# EAGLE schematic DIABETO_BLE (EAGLE 6.1)
AUTHOR: Vishal Chavan

## Sheet 1 of 2
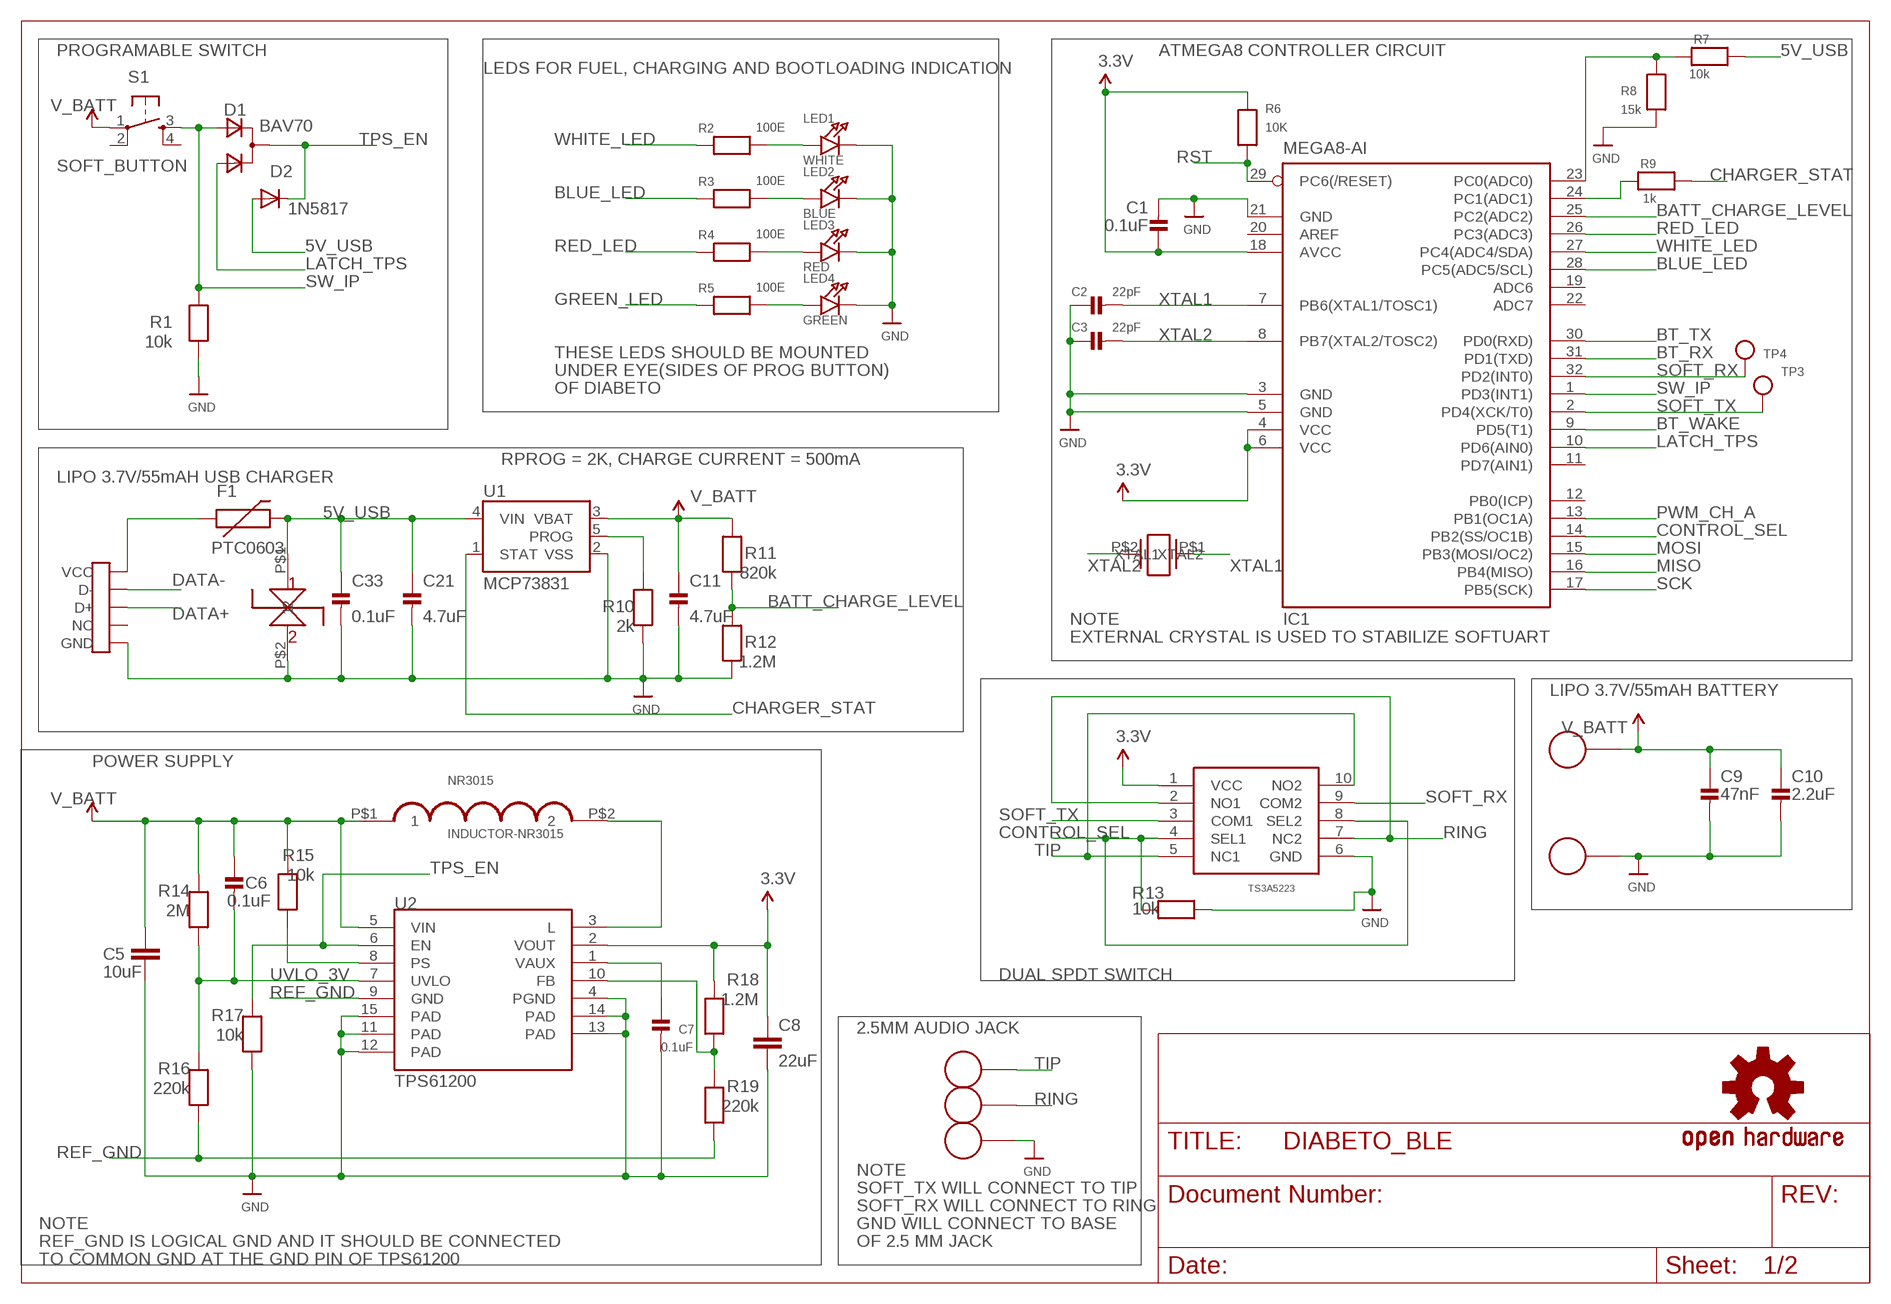
[diagram p0: schematic, sheet 1]

### Parts
BAT-  TIP  1X01_ROUND  [1X01_ROUND]
C1  0.1uF  CAP_CERAMIC_0603  [_0603]
C2  22pF  CAP_CERAMIC_0402  [_0402]
C3  22pF  CAP_CERAMIC_0402  [_0402]
C5  10uF  CAP1206  [1206]
C6  0.1uF  CAP_CERAMIC_0603  [_0603]
C7  0.1uF  CAP_CERAMIC_0603  [_0603]
C8  22uF  CAP0805  [0805]
C9  47nF  CAP_CERAMIC_0603  [_0603]
C10  2.2uF  CAP_CERAMIC_0603  [_0603]
C11  4.7uF  CAP_CERAMIC_0603  [_0603]
C21  4.7uF  CAP_CERAMIC_0603  [_0603]
C33  0.1uF  CAP_CERAMIC_0603  [_0603]
D1  BAV70  D_2ASOT23  [SOT-23]
D2  1N5817  DIODESOD-123  [SOD-123]
F1  PTC0603  [0603]
IC1  MEGA8-AI  [TQFP32-08]
LED1  WHITE  LED0603  [CHIPLED_0603]
LED2  BLUE  LED0603  [CHIPLED_0603]
LED3  RED  LED0603  [CHIPLED_0603]
LED4  GREEN  LED0603  [CHIPLED_0603]
NR3015  INDUCTOR-NR3015  [INDUCTOR-NR3015]
R1  10k  RESISTOR_0603  [_0603]
R2  100E  RESISTOR_0603  [_0603]
R3  100E  RESISTOR_0603  [_0603]
R4  100E  RESISTOR_0603  [_0603]
R5  100E  RESISTOR_0603  [_0603]
R6  10K  RESISTOR_0603  [_0603]
R7  10k  RESISTOR_0603  [_0603]
R8  15k  RESISTOR_0603  [_0603]
R9  1k  RESISTOR_0603  [_0603]
R10  2k  RESISTOR_0603  [_0603]
R11  820k  RESISTOR_0603  [_0603]
R12  1.2M  RESISTOR_0603  [_0603]
R13  10k  RESISTOR_0603  [_0603]
R14  2M  RESISTOR_0603  [_0603]
R15  10k  RESISTOR_0603  [_0603]
R16  220k  RESISTOR_0603  [_0603]
R17  10k  RESISTOR_0603  [_0603]
R18  1.2M  RESISTOR_0603  [_0603]
R19  220k  RESISTOR_0603  [_0603]
S1  SOFT_BUTTON  TAC_SWITCHSMD  [TACTILE_SWITCH_SMD]
TIP  TIP  1X01_ROUND  [1X01_ROUND]
TIP1  TIP  1X01_ROUND  [1X01_ROUND]
TP3  TESTPOINTROUND1MM  [TESTPOINT_ROUND_1MM]
TP4  TESTPOINTROUND1MM  [TESTPOINT_ROUND_1MM]
U1  MCP73831  [SOT23-5]
U2  TPS61200  [QFN-10_PAD]
U$2  MICRO_USB_DIABETOMICRO_USB_SMD  [MICRO_USB_DIABETO]
U$4  TVS_DIODE  [0603]
U$20  TS3A5223  [TS3A5223-QFN]
U$21  OSHW-LOGOS  [OSHW-LOGO-S]
U$23  8MHZ  NX5032GA  [5X3.2_2PAD]
U$26  1X01_ROUND  [1X01_ROUND]
U$28  1X01_ROUND  [1X01_ROUND]

### Nets
3.3V: C1.1 C8.1 IC1.4(VCC) IC1.6(VCC) IC1.18(AVCC) R6.2 R18.2 U2.2(VOUT) U$20.1(VCC) ; also sheet 2
5V_USB: C21.1 C33.1 D2.A F1.2 R7.1 U1.4(VIN) U$4.P$1
BATT_CHARGE_LEVEL: IC1.25(PC2(ADC2)) R11.1 R12.2
BLUE_LED: IC1.28(PC5(ADC5/SCL)) R3.2
BT_RX: IC1.31(PD1(TXD)) ; also sheet 2
BT_TX: IC1.30(PD0(RXD)) ; also sheet 2
BT_WAKE: IC1.9(PD5(T1)) ; also sheet 2
CHARGER_STAT: R9.1 U1.1(STAT)
CONTROL_SEL: IC1.14(PB2(SS/OC1B)) R13.2 U$20.4(SEL1) U$20.8(SEL2)
DATA+: U$2.P$3(D+) ; also sheet 2
DATA-: U$2.P$6(D-) ; also sheet 2
GND: BAT-.P$1 C1.2 C2.1 C3.1 C5.2 C7.2 C8.2 C9.2 C10.2 C11.2 C21.2 C33.2 IC1.3(GND) IC1.5(GND) IC1.21(GND) LED1.C LED2.C LED3.C LED4.C R1.1 R8.2 R10.1 R12.1 R13.1 R17.1 U1.2(VSS) U2.4(PGND) U2.11(PAD) U2.12(PAD) U2.13(PAD) U2.14(PAD) U2.15(PAD) U$2.P$5(GND) U$4.P$2 U$20.6(GND) U$28.P$1 ; also sheet 2
GREEN_LED: R5.2 ; also sheet 2
L: NR3015.P$2 U2.3(L)
LATCH_TPS: D1.3(A2) IC1.10(PD6(AIN0))
MISO: IC1.16(PB4(MISO)) ; also sheet 2
MOSI: IC1.15(PB3(MOSI/OC2)) ; also sheet 2
N$1: R10.2 U1.5(PROG)
N$2: LED1.A R2.1
N$3: LED2.A R3.1
N$4: C7.1 U2.1(VAUX)
N$5: R18.1 R19.2 U2.10(FB)
N$7: R15.1 U2.8(PS)
N$8: F1.1 U$2.P$7(VCC)
N$11: LED3.A R4.1
N$16: LED4.A R5.1
N$17: IC1.24(PC1(ADC1)) R9.2
N$18: IC1.23(PC0(ADC0)) R7.2 R8.1
PWM_CH_A: IC1.13(PB1(OC1A)) ; also sheet 2
RED_LED: IC1.26(PC3(ADC3)) R4.2
REF_GND: R16.1 R19.1 U2.9(GND)
RING: U$20.2(NO1) U$20.7(NC2) U$26.P$1
RST: IC1.29(PC6(/RESET)) R6.1 ; also sheet 2
SCK: IC1.17(PB5(SCK)) ; also sheet 2
SOFT_RX: IC1.32(PD2(INT0)) TP4.P$1 U$20.9(COM2)
SOFT_TX: IC1.2(PD4(XCK/T0)) TP3.P$1 U$20.3(COM1)
SW_IP: D1.2(A1) IC1.1(PD3(INT1)) R1.2 S1.3
TIP: TIP.P$1 U$20.5(NC1) U$20.10(NO2)
TPS_EN: D1.1(C) D2.C R17.2 U2.6(EN)
UVLO_3V: C6.2 R14.1 R16.2 U2.7(UVLO)
V_BATT: C5.1 C6.1 C9.1 C10.1 C11.1 NR3015.P$1 R11.2 R14.2 R15.2 S1.1 TIP1.P$1 U1.3(VBAT) U2.5(VIN)
WHITE_LED: IC1.27(PC4(ADC4/SDA)) R2.2
XTAL1: C2.2 IC1.7(PB6(XTAL1/TOSC1)) U$23.P$1(XTAL1)
XTAL2: C3.2 IC1.8(PB7(XTAL2/TOSC2)) U$23.P$2(XTAL2)
Unconnected: IC1.11(PD7(AIN1)) IC1.12(PB0(ICP)) IC1.19(ADC6) IC1.20(AREF) IC1.22(ADC7) S1.2 S1.4 U$2.P$4(NC)

### Notes on the sheet
- PROGRAMABLE SWITCH | ATMEGA8 CONTROLLER CIRCUIT
- LEDS FOR FUEL, CHARGING AND BOOTLOADING INDICATION
- THESE LEDS SHOULD BE MOUNTED
- UNDER EYE(SIDES OF PROG BUTTON)
- OF DIABETO
- RPROG = 2K, CHARGE CURRENT = 500mA
- LIPO 3.7V/55mAH USB CHARGER
- NOTE
- EXTERNAL CRYSTAL IS USED TO STABILIZE SOFTUART
- LIPO 3.7V/55mAH BATTERY
- POWER SUPPLY
- DUAL SPDT SWITCH
- 2.5MM AUDIO JACK
- NOTE
- SOFT_TX WILL CONNECT TO TIP
- SOFT_RX WILL CONNECT TO RING
- NOTE | GND WILL CONNECT TO BASE
- REF_GND IS LOGICAL GND AND IT SHOULD BE CONNECTED | OF 2.5 MM JACK
- TO COMMON GND AT THE GND PIN OF TPS61200

## Sheet 2 of 2
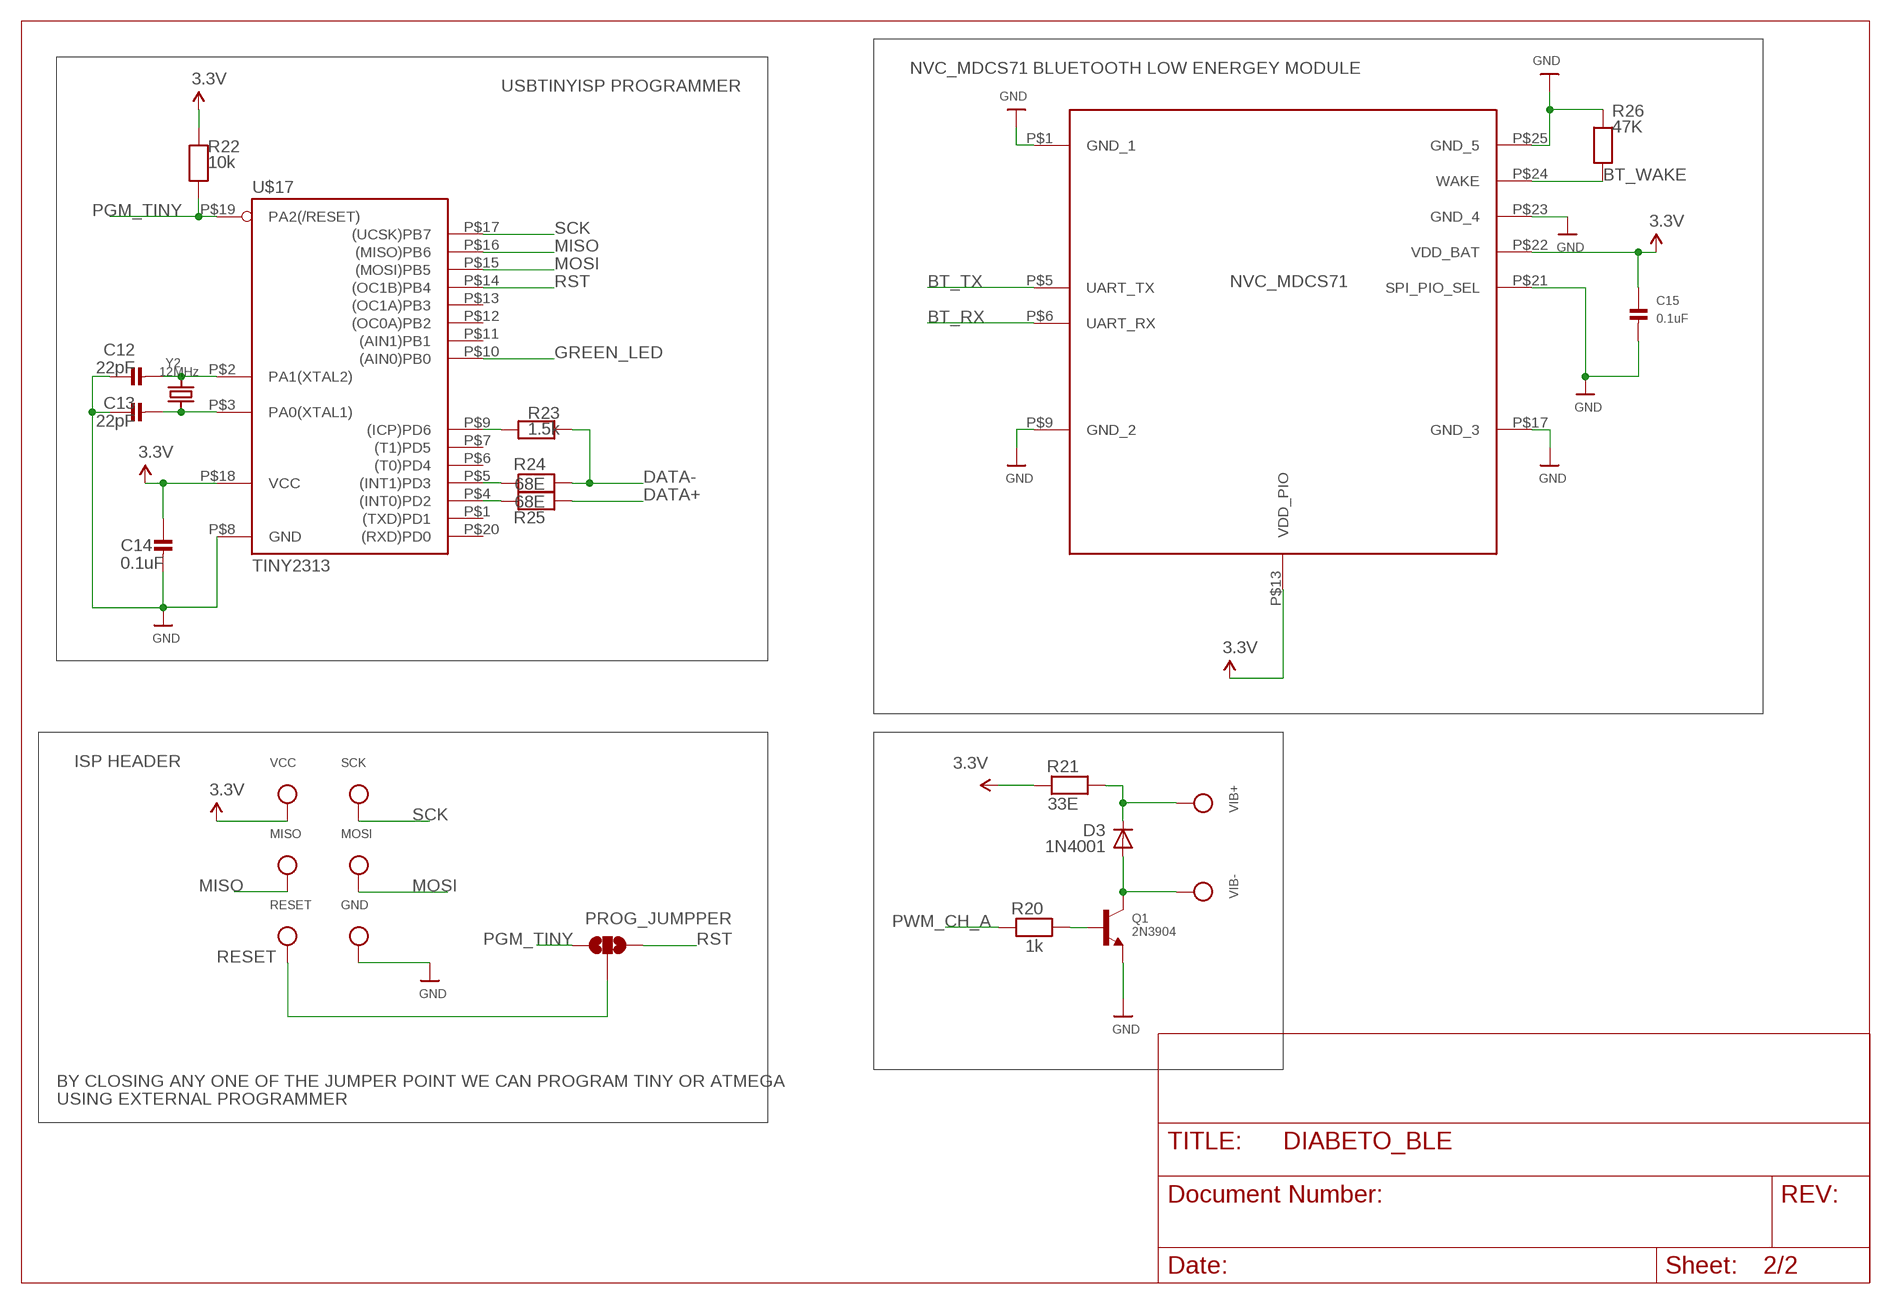
[diagram p1: schematic, sheet 2]

### Parts
C12  22pF  CAP_CERAMIC_0402  [_0402]
C13  22pF  CAP_CERAMIC_0402  [_0402]
C14  0.1uF  CAP_CERAMIC_0603  [_0603]
C15  0.1uF  CAP_CERAMIC_0603  [_0603]
D3  1N4001  DIODESOD  [SOD-323]
GND  TESTPOINT0.1"  [1X01_ROUND]
MISO  TESTPOINTROUND1MM  [TESTPOINT_ROUND_1MM]
MOSI  TESTPOINTROUND1MM  [TESTPOINT_ROUND_1MM]
PROG_JUMPPER  SOLDERJUMPER_2WAY-OLDS  [SJ_3]
Q1  2N3904  TRANSISTOR_NPN  [SOT23-R]
R20  1k  RESISTOR_0603  [_0603]
R21  33E  RESISTOR_0603  [_0603]
R22  10k  RESISTOR_0603  [_0603]
R23  1.5k  RESISTOR_0603  [_0603]
R24  68E  RESISTOR_0603  [_0603]
R25  68E  RESISTOR_0603  [_0603]
R26  47K  RESISTOR_0603  [_0603]
RESET  TESTPOINTROUND1MM  [TESTPOINT_ROUND_1MM]
SCK  TESTPOINTROUND1MM  [TESTPOINT_ROUND_1MM]
U$9  NVC_MDCS71SMD  [NVC_MDCS71]
U$17  TINY2313  TINY2313-*M*  [MLF20]
VCC  TESTPOINT0.1"  [1X01_ROUND]
VIB+  TESTPOINTROUND0.5MM  [TESTPOINT_ROUND_0.5MM]
VIB-  TESTPOINTROUND0.5MM  [TESTPOINT_ROUND_0.5MM]
Y2  12MHz  CRYSTALTHIN  [CRYSTAL_3.2X2.5]

### Nets
3.3V: C14.1 C15.1 R21.1 R22.1 U$9.P$13(VDD_PIO) U$9.P$22(VDD_BAT) U$17.P$18(VCC) VCC.1 ; also sheet 1
BT_RX: U$9.P$6(UART_RX) ; also sheet 1
BT_TX: U$9.P$5(UART_TX) ; also sheet 1
BT_WAKE: R26.2 U$9.P$24(WAKE) ; also sheet 1
DATA+: R25.2 ; also sheet 1
DATA-: R23.1 R24.2 ; also sheet 1
GND: C12.1 C13.1 C14.2 C15.2 GND.1 Q1.2(E) R26.1 U$9.P$1(GND_1) U$9.P$9(GND_2) U$9.P$17(GND_3) U$9.P$21(SPI_PIO_SEL) U$9.P$23(GND_4) U$9.P$25(GND_5) U$17.P$8(GND) ; also sheet 1
GREEN_LED: U$17.P$10((AIN0)PB0) ; also sheet 1
MISO: MISO.P$1 U$17.P$16((MISO)PB6) ; also sheet 1
MOSI: MOSI.P$1 U$17.P$15((MOSI)PB5) ; also sheet 1
N$6: D3.2(A) Q1.3(C) VIB-.P$1
N$9: R25.1 U$17.P$4((INT0)PD2)
N$10: D3.1(C) R21.2 VIB+.P$1
N$12: C13.2 U$17.P$3(PA0(XTAL1)) Y2.1
N$13: C12.2 U$17.P$2(PA1(XTAL2)) Y2.2
N$14: R24.1 U$17.P$5((INT1)PD3)
N$15: R23.2 U$17.P$9((ICP)PD6)
N$22: Q1.1(B) R20.2
PGM_TINY: PROG_JUMPPER.1 R22.2 U$17.P$19(PA2(/RESET))
PWM_CH_A: R20.1 ; also sheet 1
RESET: PROG_JUMPPER.2 RESET.P$1
RST: PROG_JUMPPER.3 U$17.P$14((OC1B)PB4) ; also sheet 1
SCK: SCK.P$1 U$17.P$17((UCSK)PB7) ; also sheet 1
Unconnected: U$17.P$1((TXD)PD1) U$17.P$6((T0)PD4) U$17.P$7((T1)PD5) U$17.P$11((AIN1)PB1) U$17.P$12((OC0A)PB2) U$17.P$13((OC1A)PB3) U$17.P$20((RXD)PD0)

### Notes on the sheet
- NVC_MDCS71 BLUETOOTH LOW ENERGEY MODULE
- USBTINYISP PROGRAMMER
- ISP HEADER
- BY CLOSING ANY ONE OF THE JUMPER POINT WE CAN PROGRAM TINY OR ATMEGA
- USING EXTERNAL PROGRAMMER

## Library data of the parts
BAT- TIP TIP1 U$26 U$28 = 1x01_round:1X01_ROUND
C1-C3 C6 C7 C9-C15 C21 C33 = microbuilder:CAP_CERAMIC: Ceramic Capacitors 0402 - 0402 Surface Mount Capacitors 16pF 50V 5% [Digikey: 445-4899-2-ND] 18pF 50V 5% [Digikey: 490-1281-2-ND] 22pF 50V 5% [Digikey: 490-1283-2-ND] 68pF 50V 5% [Digikey: 490-1289-2-ND] 0.1uF 10V 10% [Digikey: 490-1318-2-ND] 1.0uF 6.3V 10% [Digikey: 490-1320-2-ND] 0603 - 0603 Surface Mount Capacitors 16 pF 50V 5% [Digikey: 445-5051-2-ND] 22 pF 50V [Digikey: PCC220ACVTR-ND] 33 pF 50V 5% [Digikey: 490-1415-1-ND] 56pF 50V 5% [Digikey: 490-1421-1-ND] 220pF 50V 5% [Digikey: 445-1285-1-ND] 680 pF 50V 2200 pF 50V 5% C0G [Digikey: 445-1297-1-ND] 5600 pF 100V 5% X7R [Digikey: 478-3711-1-ND] 0.1 µF 25V 10% [Digikey: PCC2277TR-ND] 0.22 µF 16V 10% X7R [Digikey: 445-1318-1-ND] 1.0 µF 25V 10% [Digikey: 445-5146-2-ND] 0603 - RF Specific 3pF 250V +/-0.1pF RF [Digikey: 712-1347-1-ND] 18 pF 250V 5% [Digikey: 478-3505-1-ND or 712-1322-1-ND] 56 pF 250V 5% C0G RF [Digikey: 490-4867-1-ND] 68 pF 250V RF [Digikey: 490-4868-1-ND] 0805 - 0805 Surface Mount Capacitors 220 pF 250V 2% RF Ceramic Capacitor [Digikey: 712-1398-1-ND] 1000 pF 50V 2% NP0 Ceramic Capacitor [Digikey: 478-3760-1-ND] 0.1 µF 25V 10% Ceramic Capacitor [Digikey: PCC1828TR-ND] 1.0 µF 16V 10% Ceramic Capacitor[Digikey: 490-1691-2-ND] 10.0 µF 10V 10% Ceramic Capacitor[Digikey: 709-1228-1-ND] 10.0 uF 16V 10% Ceramic Capacitor [Digikey: 478-5165-2-ND] 47 uF 6.3V 20% Ceramic Capacitor [Digikey: 587-1779-1-ND or 399-5506-1-ND] 1206 - 1206 Surface Mount Capacitors 47uF 10V 20% Ceramic Capacitor [Digikey: 490-5528-1-ND or 399-5508-1-ND or 445-6010-1-ND] 100uF 6.3V -20%, +80% Y5V Ceramic Capacitor (Digikey: 490-4512-1-ND, Mouser: 81-GRM31CF50J107ZE1L)
C5 C8 = SparkFun-Capacitors:CAP: Capacitor Standard 0603 ceramic capacitor, and 0.1" leaded capacitor.
D1 = zetex:D_2A: Dual DIODE; OC_FARNELL: unknown; OC_NEWARK: unknown
D2 = microbuilder:DIODE: Diode
D3 = SparkFun:DIODE: Diode
F1 = SparkFun-PowerIC:PTC: Resettable Fuse PTC Resettable Fuse. Spark Fun Electronics SKU : COM-08357
GND VCC = microbuilder:TESTPOINT: Test Point Various test points for characterisation and PCB testing TESTPOINT_SMT - Compact Surface Mount Test Point [Digikey: 5016KTR-ND]; BOM: EXCLUDE
IC1 = atmel:MEGA8: MICROCONTROLLER 8 Kbytes FLASH, 1 kbytes SRAM, 512 bytes EEPROM, USART, 6-channel 10 bit ADC, 2-channel 8 bit ADC Pin compatible with Atmega48, ATMega88, ATMega168 Source: avr.lbr; MPN: ATMEGA8-16AU; OC_FARNELL: 9171371; OC_NEWARK: 73M8863
LED1-LED4 = microbuilder:LED: LED 0603 - 0603 Surface Mount Package 2mA: Green LED - Low Power (3.9mcd, 2ma, 1.7Vf) - Digikey: 475-2709-2-ND Orange LED - Low Power (9.8mcd, 2ma, 1.8Vf) - Digikey: 475-1194-2-ND Red LED - Low Power (5mcd, 2ma, 1.8Vf) - Digikey: 475-1195-2-ND Yellow LED - Low Power (7mcd, 2ma, 1.8Vf) - Digikey: 475-1196-2-ND 5mA: Blue LED - Low Power (17mcd, 5ma, 2.9Vf) - Digikey: LNJ937W8CRACT-ND 0805 - 0805 Surface Mount Package 2mA: Red LED (8.8mcd, 2mA, 1.8Vf, Clear) - Low Power [Digikey: 475-2510-1-ND] Green LED (5mcd, 2mA, 1.8Vf, Clear) - Low Power [Digikey: 475-2730-1-ND] Yellow LED (11.3mcd, 2mA, 1.8Vf, Clear) - Low Power [Digikey: 475-2555-1-ND] 20mA: Red LED (104mcd, 20mA, Diffused) - LS R976 [Digikey: 475-1278-6-ND] Red LED (12mcd, 20mA, 2.0Vf, Clear) - APT2012EC [Digikey: 754-1128-1-ND] Green LED (15mcd, 20mA, 2.2Vf, Clear) - APT2012GC [Digikey: 754-1131-1-ND] Orange LED (160mcd, 20mA, 2.1Vf, Clear) - APT2012SECK [Digikey: 754-1130-1-ND] 1206 - 1206 Surface Mount Package Green LED (26mcd, 20mA, Diffused) - LG N971 [Digikey: 475-1407-6-ND] Red LED (15mcd, 20mA, Diffused) - LH N974 [Digikey: 475-1416-6-ND]
MISO MOSI RESET SCK TP3 TP4 VIB+ VIB- = microbuilder:TESTPOINT: Test Point Various test points for characterisation and PCB testing TESTPOINT_SMT - Compact Surface Mount Test Point [Digikey: 5016KTR-ND]
NR3015 = farasbee:INDUCTOR-NR3015
PROG_JUMPPER = SparkFun:SOLDERJUMPER_2WAY-OLD: Solder Jumper 2 way solder jumper
Q1 = microbuilder:TRANSISTOR_NPN: NPN Transistor Transistor (NPN) 500mA 45V - BC817 [Digikey: 568-1631-1-ND] Transistor (NPN) 500mA 45V - BC817,215 [Mouser: 771-BC817-T/R] SOT23-R - SOT23 footprint optimised for use with solder paste and reflow ovens. SOT23-W - SOT23 footprint optimised for hand-soldering (larger pads).
R1-R26 = microbuilder:RESISTOR: Resistors 0402 - 0402 Surface Mount Package 22 Ohm 1% 1/16W [Digikey: 311-22.0LRTR-ND] 33 Ohm 5% 1/16W 1.0K 5% 1/16W 1.5K 5% 1/16W 2.0K 1% 1/16W 10.0K 1% 1/16W [Digikey: 311-10.0KLRTR-ND] 10.0K 5% 1/16W [Digikey: RMCF0402JT10K0TR-ND] 12.1K 1% 1/16W [Digikey: 311-22.0LRTR-ND] 100.0K 5% 1/16W 0603 - 0603 Surface Mount Package 0 Ohm 1/10 Watt 1% Resistor 15 Ohm 1/10 Watt 1% Resistor 33 Ohm 1/10 Watt 1% Resistor 49.9 Ohm 1/10 Watt 1% Resistor 100 Ohm 1/10 Watt 1% Resistor 150 Ohm 1/10 Watt 1% Resistor 240 Ohm 1/10 Watt 1% Resistor 390 Ohm 1/10 Watt 1% Resistor 560 Ohm 1/10 Watt 1% Resistor 680 Ohm 1/10 Watt 1% Resistor 750 Ohm 1/10 Watt 1% Resistor 1.0K Ohm 1/10 Watt 1% Resistor 1.5K Ohm 1/10 Watt 1% Resistor 2.0K Ohm 1/10 Watt 1% Resistor 2.2K Ohm 1/10 Watt 1% Resistor 3.3K Ohm 1/10 Watt 1% Resistor 4.7K Ohm 1/10 Watt 1% Resistor 10.0K Ohm 1/10 Watt 1% Resistor 12.0K Ohm 1/10 Watt 1% Resistor 12.1K Ohm 1/10 Watt 1% Resistor 20.0K Ohm 1/10 Watt 1% Resistor 33.0K Ohm 1/10 Watt 1% Resistor 100.0K Ohm 1/10 Watt 1% Resistor 0805 - 0805 Surface Mount Package 0 Ohm 1/8 Watt 1% Resistor 33 Ohm 1/8 Watt 1% Resistor 100 Ohm 1/8 Watt 1% Resistor 150 Ohm 1/8 Watt 1% Resistor 200 Ohm 1/8 Watt 1% Resistor 240 Ohm 1/8 Watt 1% Resistor 330 Ohm 1/8 Watt 1% Resistor 390 Ohm 1/8 Watt 1% Resistor 470 Ohm 1/8 Watt 1% Resistor 1.0K Ohm 1/8 Watt 1% Resistor 1.5K Ohm 1/8 Watt 1% Resistor 2.0K Ohm 1/8 Watt 1% Resistor 4.7K Ohm 1/8 Watt 1% Resistor 5.1K Ohm 1/8 Watt 1% Resistor 5.6K Ohm 1/8 Watt 1% Resistor 10.0K Ohm 1/8 Watt 1% Resistor 22.0K Ohm 1/8 Watt 1% Resistor 33.0K Ohm 1/8 Watt 1% Resistor 100K Ohm 1/8 Watt 1% Resistor 1206 - 1206 Surface Mount Package 2012 - 2010 Surface Mount Package 0.11 Ohm 1/2 Watt 1% Resistor - Digikey: RHM.11UCT-ND
S1 = SparkFun-Electromechanical:TAC_SWITCH: Momentary Switch Button commonly used for reset or general input. Spark Fun Electronics SKU : COM-00097 SMT- SWCH-08247; PROD_ID: SWCH-08247
U1 = SparkFun-PowerIC:MCP73831: Miniature single cell, fully integrated Li-Ion, Li-polymer charge management controller http://ww1.microchip.com/downloads/en/DeviceDoc/21984a.pdf IC-09995; PROD_ID: IC-09995
U2 = SparkFun-PowerIC:TPS61200: DC to DC Booster IC-10035; PROD_ID: IC-10035
U$2 = 5pin_micro_usb:MICRO_USB_DIABETO
U$4 = TVS_diode:TVS_DIODE
U$9 = NVC_MDCS71:NVC_MDCS71
U$17 = avr-6:TINY2313*: Atmel Tiny2313 2K Flash, 128 bytes EEPROM, 128 bytes RAM
U$20 = TS3A5223:TS3A5223
U$21 = SparkFun:OSHW-LOGO: Open Source Hardware Logo This logo indicates the piece of hardware it is found on incorporates a OSHW license and/or adheres to the definition of open source hardware found here: http://freedomdefined.org/OSHW
U$23 = ndk:NX5032GA
Y2 = microbuilder:CRYSTAL: Crystals HC49UP - Surface Mount Crystal 4.0MHz 18pF +/-30ppm Surface Mount Crystal [Digikey: 535-9857-1-ND] 12.0 MHz Surface Mount Crystal [Digikey: 535-9869-6-ND] 25.0 MHz Surface Mount Crystal [Digikey: 535-9078-1-ND] 2.5 x 2.0mm - MEMs SMT Crystal 16.0 MHz 10pF 20ppm 2.5 x 2.0mm Crystal [Digikey -40-85°C: 535-10923-1-ND] 3.2 x 2.5mm - MEMs SMT Crystal 12.0 MHz 8pF 15ppm 3.2 x 2.5mm Crystal [Digikey: -10-70°C: 644-1047-1-ND -40-125°C: 644-1128-1-ND] 16.0 MHz 8pF 15ppm 3.2 x 2.5mm Crystal [Digikey: -10-70°C: 644-1049-1-ND -40-125°C: 644-1129-2-ND] 16.0 MHz 10pF 10ppm 3.2 x 2.5mm Crystal [Digikey: 644-1100-1-ND] 27.12 MHz 18pF 30ppm 3.2 x 2.5mm Crystal [Digikey: 887-1424-1-ND] 27.12MHz 10pF 10ppm 3.2 x 2.5mm Crystal [Digikey: 887-1329-1-ND] 4.9 x 1.8mm - MEMs SMT Crystal 32.768 KHz 12.5pF 20ppm 4.9 x 1.8mm Crystal [Digikey: SE2415CT-ND] 8.0 x 3.8mm - Surface Mount Crystal 32.768kHz 12.5pF 20ppm -40°C-85°C [Digikey: 535-9166-2-ND] Cylinder 32.768KHz Cylinder Crystal (2x6mm body) [Ex. Digikey: 300-8341-2-ND]